# Altium schematic sheet Gestion_Batterie.SchDoc: Carte de gestion de batterie Li-ion
size A4; Date: 05/05/2026; Author: P. FISCHER; CompanyName: YNOV CAMPUS BORDEAUX; DrawnBy: P. FISCHER; DocumentNumber: SCH_GESTION_BATTERIE_LI-ION -; Revision: A.0; SheetNumber: 1; SheetTotal: 1
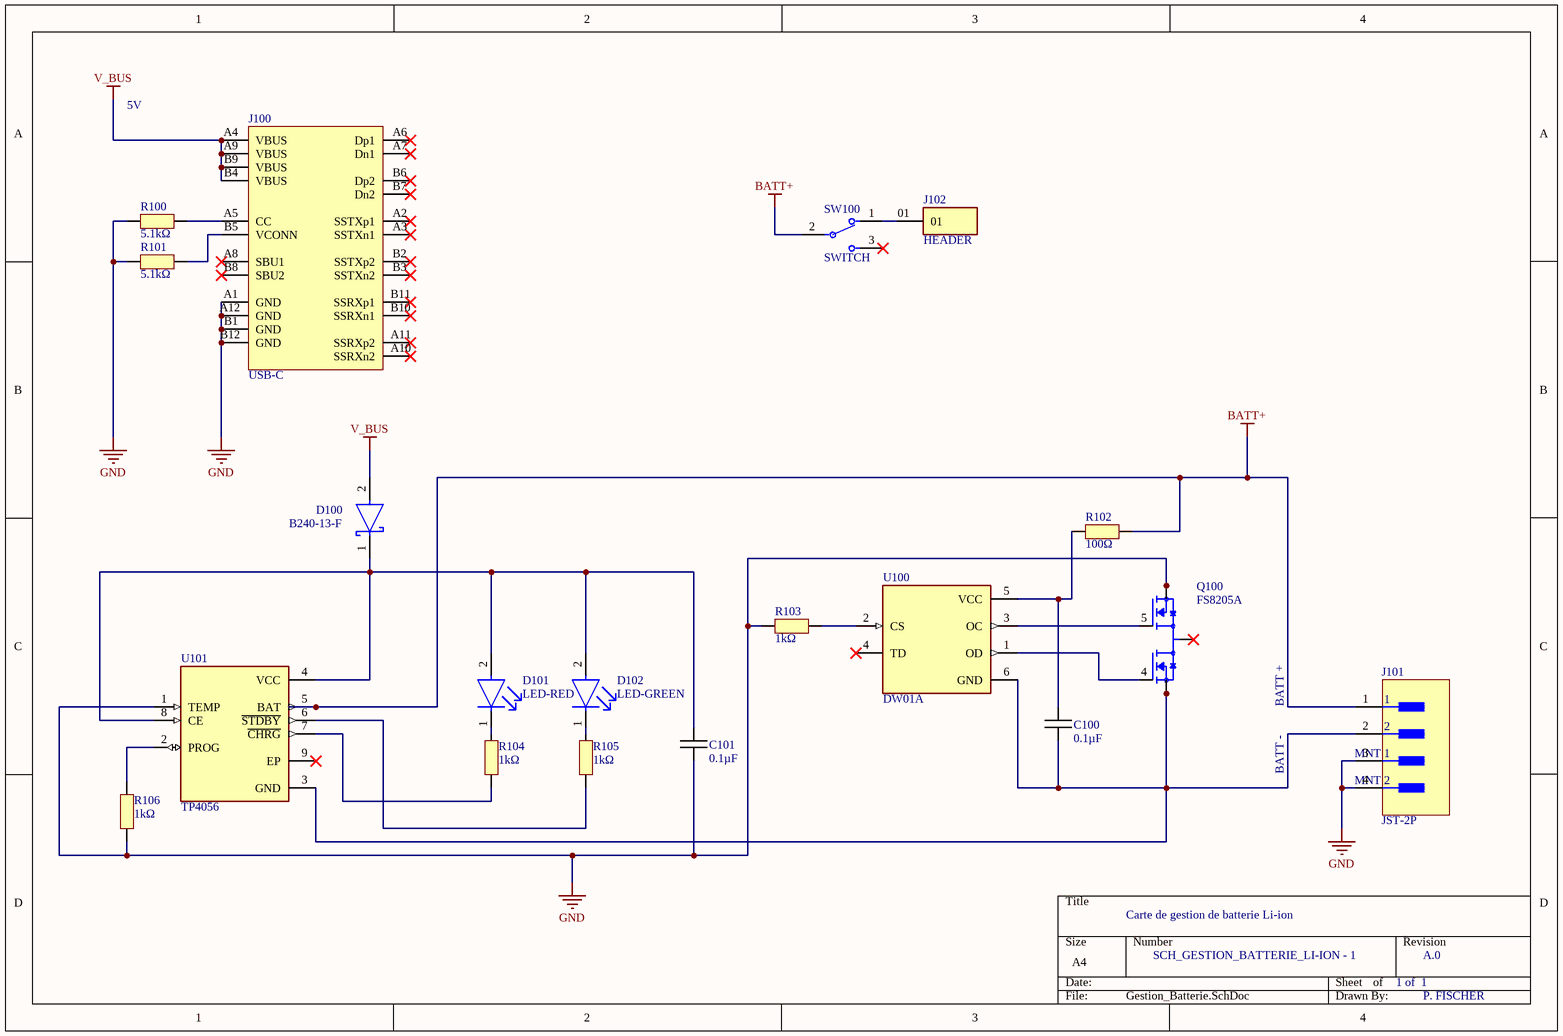
[diagram p0: Gestion_Batterie.SchDoc]

## Parts
C100  0.1µF  [SMD-1005-CAP]
C101  0.1µF  [SMD-1005-CAP]
D100  B240-13-F  [SMD-DIODE-SCHOTTKY]
D101  LED-RED  [SMD-1608-LED]
D102  LED-GREEN  [SMD-1608-LED]
J100  USB-C  [USB-C]
J101  JST-2P  [SMD-JST-2P]
J102  HEADER  [HEADER]
Q100  FS8205A  [FS8205A]
R100  5.1kΩ  [SMD-1005-RES]
R101  5.1kΩ  [SMD-1005-RES]
R102  100Ω  [SMD-1005-RES]
R103  1kΩ  [SMD-1005-RES]
R104  1kΩ  [SMD-1005-RES]
R105  1kΩ  [SMD-1005-RES]
R106  1kΩ  [SMD-1005-RES]
SW100  SWITCH  [SMD-SWITCH]
U100  DW01A  [DW01A]
U101  TP4056  [SOP-8-TP4056]

## Nets
BATT+: J101.1 R102.2 SW100.2(C) U101.5(BAT)
GND: C101.1 J100.A1(GND) J100.A12(GND) J100.B1(GND) J100.B12(GND) J101.3(MNT_1) J101.4(MNT_2) Q100.6(S2) Q100.7(S2) R100.1 R101.1 R103.1 R106.1 U101.1(TEMP)
V_BUS: D100.2(A) J100.A4(VBUS) J100.A9(VBUS) J100.B4(VBUS) J100.B9(VBUS)
NetC100_1: C100.1 R102.1 U100.5(VCC)
NetC100_2: C100.2 J101.2 Q100.2(S1) Q100.3(S1) U100.6(GND) U101.3(GND)
NetC101_2: C101.2 D100.1(C) D101.2(A) D102.2(A) U101.4(VCC) U101.8(CE)
NetD101_1: D101.1(C) R104.2
NetD102_1: D102.1(C) R105.2
NetJ100_A5: J100.A5(CC) R100.2
NetJ100_B5: J100.B5(VCONN) R101.2
NetJ102_01: J102.01 SW100.1
NetQ100_1: Q100.1(D12) Q100.8(D12)
NetQ100_4: Q100.4(G1) U100.1(OD)
NetQ100_5: Q100.5(G2) U100.3(OC)
NetR103_2: R103.2 U100.2(CS)
NetR104_1: R104.1 U101.7(~{CHRG})
NetR105_1: R105.1 U101.6(~{STDBY})
NetR106_2: R106.2 U101.2(PROG)

Not connected (* = marked no-connect by the designer): J100 A2(SSTXp1)* A3(SSTXn1)* A6(Dp1)* A7(Dn1)* A8(SBU1)* A10(SSRXn2)* A11(SSRXp2)* B2(SSTXp2)* B3(SSTXn2)* B6(Dp2)* B7(Dn2)* B8(SBU2)* B10(SSRXn1)* B11(SSRXp1)*; SW100 3*; U100 4(TD)*; U101 9(EP)*

## Notes on the sheet
- 5V
- BATT +
- BATT -

## Library data of the parts
C100 C101 = CAPACITOR
D100 = DIODE-SCHOTTKY-B240-13-F: DIODE SCHOTTKY 40V 2A SMB; Manufacturer: Diodes Inc.; Capacitance: 200pF; Peak Reverse Current: 0.5mA; Max Junction Temp: +150°C; Value: 200pF; Max Surge Forward Current: 50A; Standoff Height: 0.05mm; Forward Current: 2A; Device Class L2: Diodes; Device Class L1: Discrete Semiconductors; Reverse Voltage: 40V; Automotive: No; Lead Free: Yes; Octopart: https://octopart.com/b240-13-f-diodes+inc.-325780; Device Class L3: Schottky Diodes; Temperature Range Low: -65°C; RoHS: TRUE; Category: Diode; Max Repetitive Reverse Voltage: 40V; Temperature: -65°C to +150°C; ComponentLink2URL: https://www.diodes.com/assets/Datasheets/ds13004.pdf; Manufacturer Part Number: B240-13-F; Mouser Description: Schottky Diodes & Rectifiers 40V 2A; Temperature Range High: +150°C; Package: SMB; ComponentLink2Description: Datasheet; Footprint Url: https://www.diodes.com/assets/Package-Files/SMB.pdf; Height: 2.5mm; Digikey Description: DIODE SCHOTTKY 40V 2A SMB
D101 = LED-RED: LED GREEN CLEAR CHIP SMD LTST-C190GKT; Dominant Wavelength: 569nm; Reverse Voltage: 5V; Lens Color: Colorless; Viewing Angle: 130°; Voltage: 2V; Forward Current: 30mA; Power Dissipation: 100mW; Luminous Intensity: 6mcd; Number of LEDs: 1; Forward Voltage: 2.1V; Wavelength: 565nm; Test Current: 10mA; Min Operating Temperature: -55°C; Lens Style: Clear; Mount: Surface Mount; Width: 0.8mm; Packaging: Tape and Reel; Lens Transparency: Clear; Case Code (Metric): 1608; Depth: 0.8mm; Case Code (Imperial): 0603; Case/Package: 0603; Number of Pins: 2; Max Operating Temperature: 85°C; Lead Free: Lead Free; Number of Elements: 1; Length: 1.6mm; Height: 0.8mm; Package Quantity: 1; Power Rating: 100mW; Radiation Hardening: No; Illumination Color: Green; Color: Green
D102 = LED-GREEN: LED GREEN CLEAR CHIP SMD LTST-C190GKT; Dominant Wavelength: 569nm; Reverse Voltage: 5V; Lens Color: Colorless; Viewing Angle: 130°; Voltage: 2V; Forward Current: 30mA; Power Dissipation: 100mW; Luminous Intensity: 6mcd; Number of LEDs: 1; Forward Voltage: 2.1V; Wavelength: 565nm; Test Current: 10mA; Min Operating Temperature: -55°C; Lens Style: Clear; Mount: Surface Mount; Width: 0.8mm; Packaging: Tape and Reel; Lens Transparency: Clear; Case Code (Metric): 1608; Depth: 0.8mm; Case Code (Imperial): 0603; Case/Package: 0603; Number of Pins: 2; Max Operating Temperature: 85°C; Lead Free: Lead Free; Number of Elements: 1; Length: 1.6mm; Height: 0.8mm; Package Quantity: 1; Power Rating: 100mW; Radiation Hardening: No; Illumination Color: Green; Color: Green
J100 = USB-C: NexarPartId: 68112675; Pin Length: 1.9mm; Current Rating: 5A; Gender: Receptacle; Voltage Rating: 20V; Number of Contacts: 24; Insulation Resistance: 1GΩ; USB Standard: USB 3.1; Connector Type: USB; Contact Resistance: 30mΩ; Min Operating Temperature: -40°C; Mount: Surface Mount, Through Hole; Height: 3.21mm; Number of Pins: 24; RoHS: Compliant; Orientation: Horizontal; Max Operating Temperature: 105°C; Packaging: Tape and Reel; Contact Material: Gold, Nickel
J101 = JST-2P: Connector Header Surface Mount, Right Angle 2 position 0.079" (2.00mm); NexarPartId: 22059567; Number of Contacts: 2; Gender: Male; Voltage Rating: 250V; Current Rating: 3A; Packaging: Cut Tape; Height: 5.7mm; Max Operating Temperature: 85°C; Mount: Surface Mount; Termination: SMD/SMT; Min Operating Temperature: -25°C; Number of Rows: 1; Contact Plating: Tin; Lead Free: Lead Free; RoHS: Compliant; Contact Material: Copper
J102 = HEADER: Connector Header Through Hole 1 position; MF: Samtec; MP: MTMM-101-05-G-S-225; SnapEDA_Link: https://www.snapeda.com/parts/MTMM-101-05-G-S-225/Samtec/view-part/?ref=snap; Package: None; Value: *; Check_prices: https://www.snapeda.com/parts/MTMM-101-05-G-S-225/Samtec/view-part/?ref=eda
Q100 = FS8205A: N/A; MF: Fortune Semiconductor; MP: FS8205A; Value: *; Availability: Not in stock; Package: Package; Price: None; SnapEDA_Link: https://www.snapeda.com/parts/FS8205A/Fortune+Semiconductor/view-part/?ref=snap; Check_prices: https://www.snapeda.com/parts/FS8205A/Fortune+Semiconductor/view-part/?ref=eda
R100-R106 = RESISTOR
SW100 = SWITCH: SWITCH SLIDE SPDT 300MA 6V JS102011SCQN; Electrical Life: 5000Cycles; Actuator Type: Standard; Contact Resistance: 70mR; Actuator Material: Nylon; Max Voltage Rating (DC): 30V; Actuator Length: 2mm; Switch Function: On-On; Actuator Color: Black; Radiation Hardening: No; Throw Configuration: SPDT; Depth: 7.5mm; Case/Package: SMD/SMT; Package Quantity: 4000; Min Operating Temperature: -40°C; Length: 8.5mm; Current Rating: 300mA; Mount: Surface Mount; Voltage Rating (DC): 6V; RoHS Compliant: Yes; Orientation: Straight; Housing Material: Nylon; Contact Plating: Silver; Max Operating Temperature: 85°C; Packaging: Tape and Reel; Switch Travel: 2mm; Max Current Rating: 300mA; Contact Material: Copper Alloy; Series: JS; Termination: Gull Wing
U100 = DW01A: One Cell Lithium-ion/Polymer Battery Protection IC; MF: Fortune Semiconductor; SnapEDA_Link: https://www.snapeda.com/parts/DW01A/Fortune+Semiconductor/view-part/?ref=snap; Package: SOT-23-6 Fortune Semiconductor; Value: *; MP: DW01A; Check_prices: https://www.snapeda.com/parts/DW01A/Fortune+Semiconductor/view-part/?ref=eda
U101 = TP4056: Complete single cell Li-Ion battery with a constant current / constant voltage linear charger; MF: NanJing Top Power ASIC Corp.; Check_prices: https://www.snapeda.com/parts/TP4056/NanJing+Top+Power+ASIC+Corp./view-part/?ref=eda; SnapEDA_Link: https://www.snapeda.com/parts/TP4056/NanJing+Top+Power+ASIC+Corp./view-part/?ref=snap; Price: None; Availability: Not in stock; Package: Package; MP: TP4056; Value: *